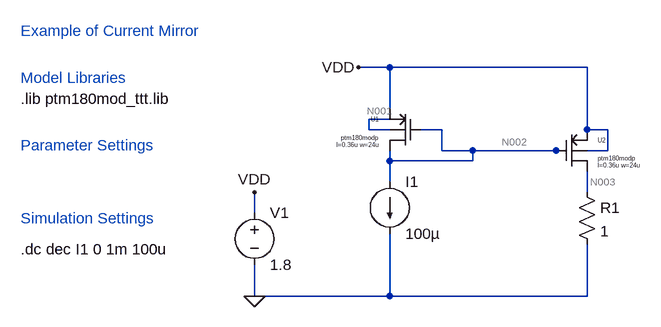
[diagram p0: schematic current_mirror_pmos.asc]
current_mirror_pmos.asc, the LTspice schematic file:
Version 4
SHEET 1 3284 784
WIRE 208 -144 160 -144
WIRE 512 -144 208 -144
WIRE 208 -80 208 -144
WIRE 208 -64 176 -64
WIRE 176 -48 176 -64
WIRE 208 -48 176 -48
WIRE 288 -48 256 -48
WIRE 512 -48 512 -144
WIRE 544 -48 512 -48
WIRE 288 -16 288 -48
WIRE 336 -16 288 -16
WIRE 464 -16 336 -16
WIRE 480 -16 464 -16
WIRE 544 -16 544 -48
WIRE 544 -16 512 -16
WIRE 208 0 208 -16
WIRE 336 0 336 -16
WIRE 336 0 208 0
WIRE 208 32 208 0
WIRE 512 48 512 16
WIRE 0 80 0 48
WIRE 0 208 0 160
WIRE 208 208 208 112
WIRE 208 208 0 208
WIRE 512 208 512 128
WIRE 512 208 208 208
FLAG 160 -144 VDD
FLAG 0 48 VDD
FLAG 0 208 0
SYMBOL voltage 0 64 R0
SYMATTR InstName V1
SYMATTR Value 1.8
SYMBOL current 208 32 R0
SYMATTR InstName I1
SYMATTR Value 100µ
SYMBOL res 496 32 R0
SYMATTR InstName R1
SYMATTR Value 1
SYMBOL cnm25mod_pmos4 256 -80 M0
SYMATTR SpiceModel ptm180modp
SYMATTR Value l=0.36u w=24u
SYMATTR InstName U1
SYMBOL cnm25mod_pmos4 464 -48 R0
SYMATTR SpiceModel ptm180modp
SYMATTR Value l=0.36u w=24u
SYMATTR InstName U2
TEXT -360 -24 Left 2 ;Parameter Settings
TEXT -360 88 Left 2 ;Simulation Settings
TEXT -360 -128 Left 2 ;Model Libraries
TEXT -360 -200 Left 2 ;Example of Current Mirror
TEXT -360 -96 Left 2 !.lib ptm180mod_ttt.lib
TEXT -360 136 Left 2 !.dc dec I1 0 1m 100u

The netlist it stands for:
* current_mirror_pmos.asc
V1 VDD 0 1.8
I1 N002 0 100µ
R1 N003 0 1
XU1 N002 N002 VDD N001 ptm180modp l=0.36u w=24u  ; pins D G S B
XU2 N003 N002 VDD VDD ptm180modp l=0.36u w=24u  ; pins D G S B
* Parameter Settings
* Simulation Settings
* Model Libraries
* Example of Current Mirror
.lib ptm180mod_ttt.lib
.dc dec I1 0 1m 100u
.backanno
.end

* Results of the author's LTspice run, read from the files saved beside the schematic
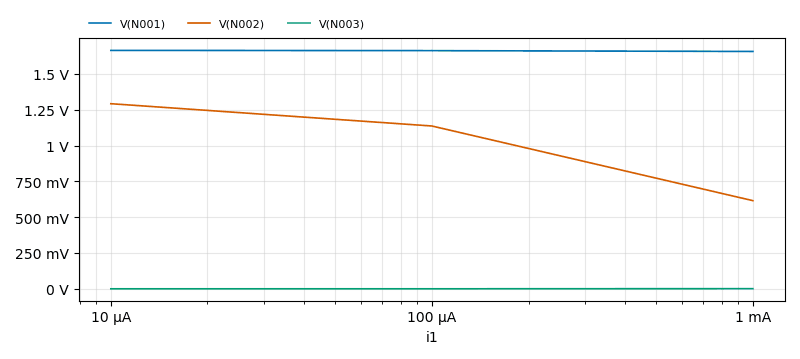
[diagram p1: DC transfer characteristic of current_mirror_pmos.asc, plotted from the saved traces]
* DC transfer characteristic, 1 run:
*   V(N001): 1.664 V at i1=10 µA, 1.656 V at i1=1 mA, min 1.656 V, max 1.664 V
*   V(N002): 1.292 V at i1=10 µA, 615.2 mV at i1=1 mA, min 615.2 mV, max 1.292 V
*   V(N003): 7.666 µV at i1=10 µA, 1.052 mV at i1=1 mA, min 7.666 µV, max 1.052 mV